# EAGLE design DESIGN7MA (EAGLE 9.6.1)
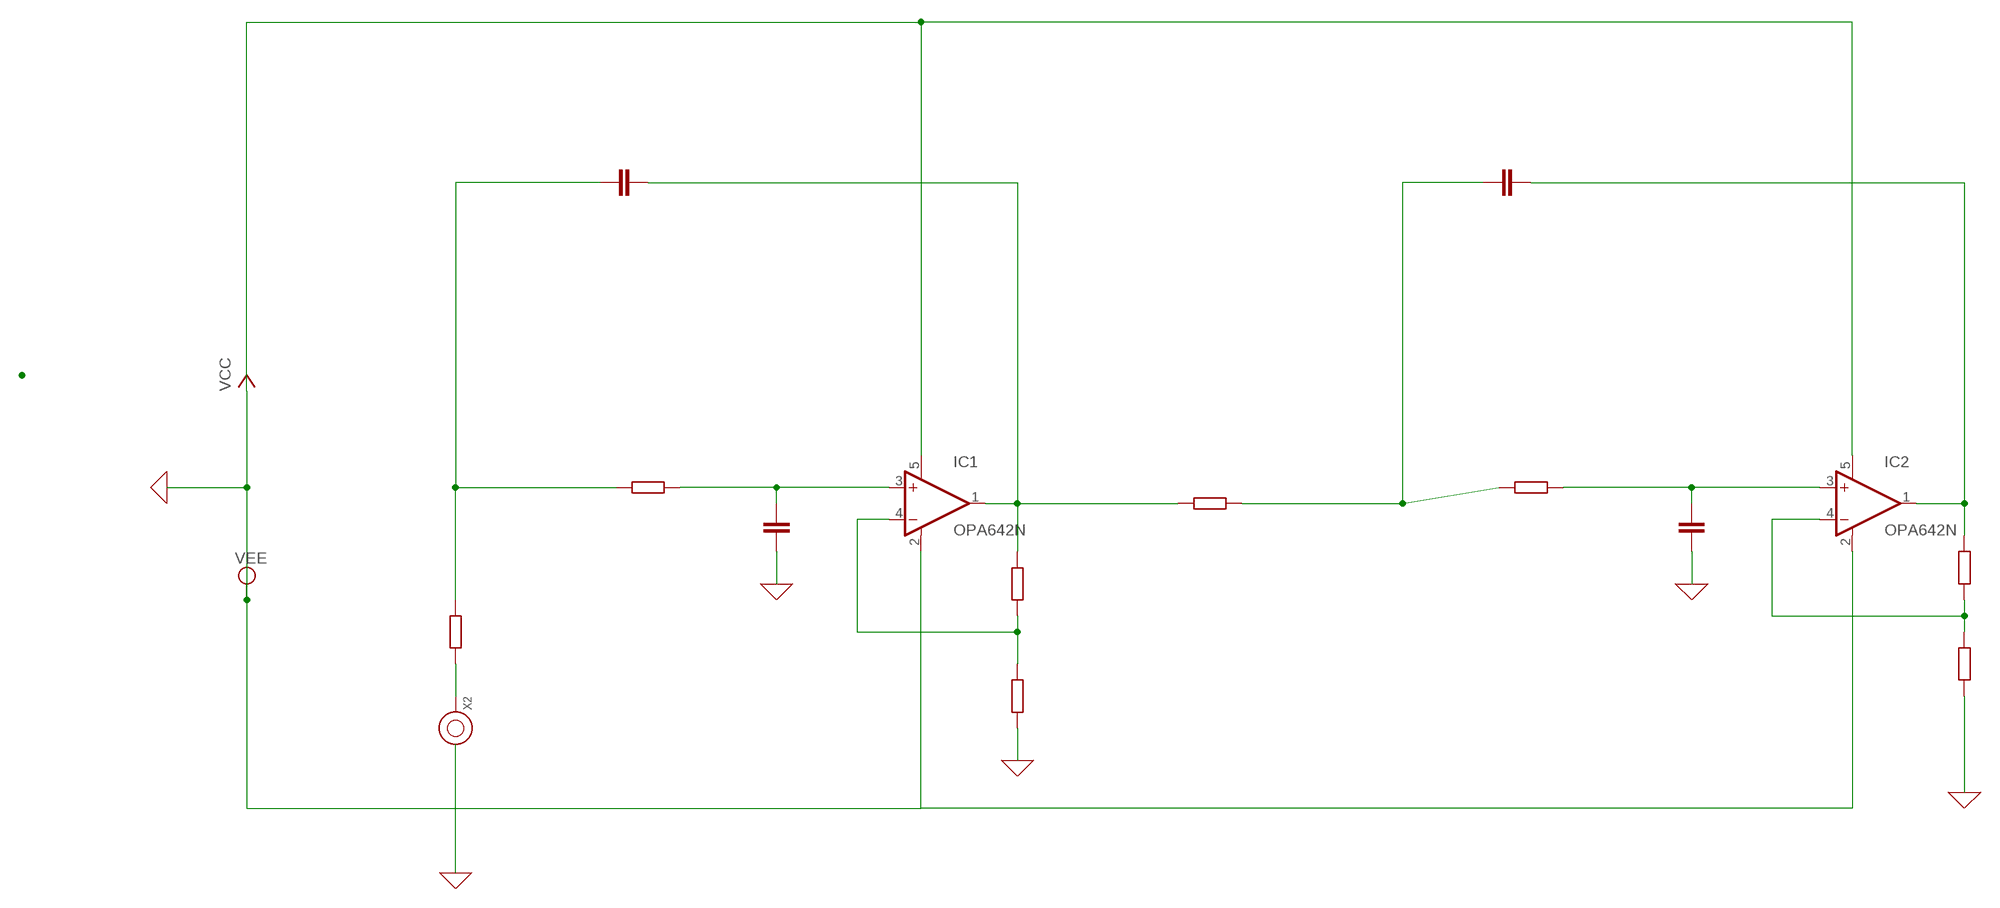
[diagram p0: schematic, sheet 1]

## Parts
IC1  OPA642N  [SOT23-5]
IC2  OPA642N  [SOT23-5]
X2  BINDING-POST  [BINDING-POST]

## Nets
0: IC1.2(V-) IC1.5(V+) IC2.2(V-) IC2.5(V+) ; supply symbol labelled GND, VCC, VEE
N$1: IC1.3(+IN)
N$2: IC1.1(OUT)
N$3: IC1.4(-IN)
N$4: IC2.1(OUT)
N$5: IC2.4(-IN)
N$7: IC2.3(+IN)
N$9: X2.1 X2.1_1 X2.1_2 X2.1_3 X2.1_4 X2.1_5 X2.1_6 X2.1_7 X2.1_8

## Library data of the parts
IC1 IC2 = burr-brown:OPA642N: Operational Amplifier Wideband, Low Distortion; OC_FARNELL: unknown; OC_NEWARK: unknown
X2 = binding-post_10:BINDING-POST: Binding post

## Board
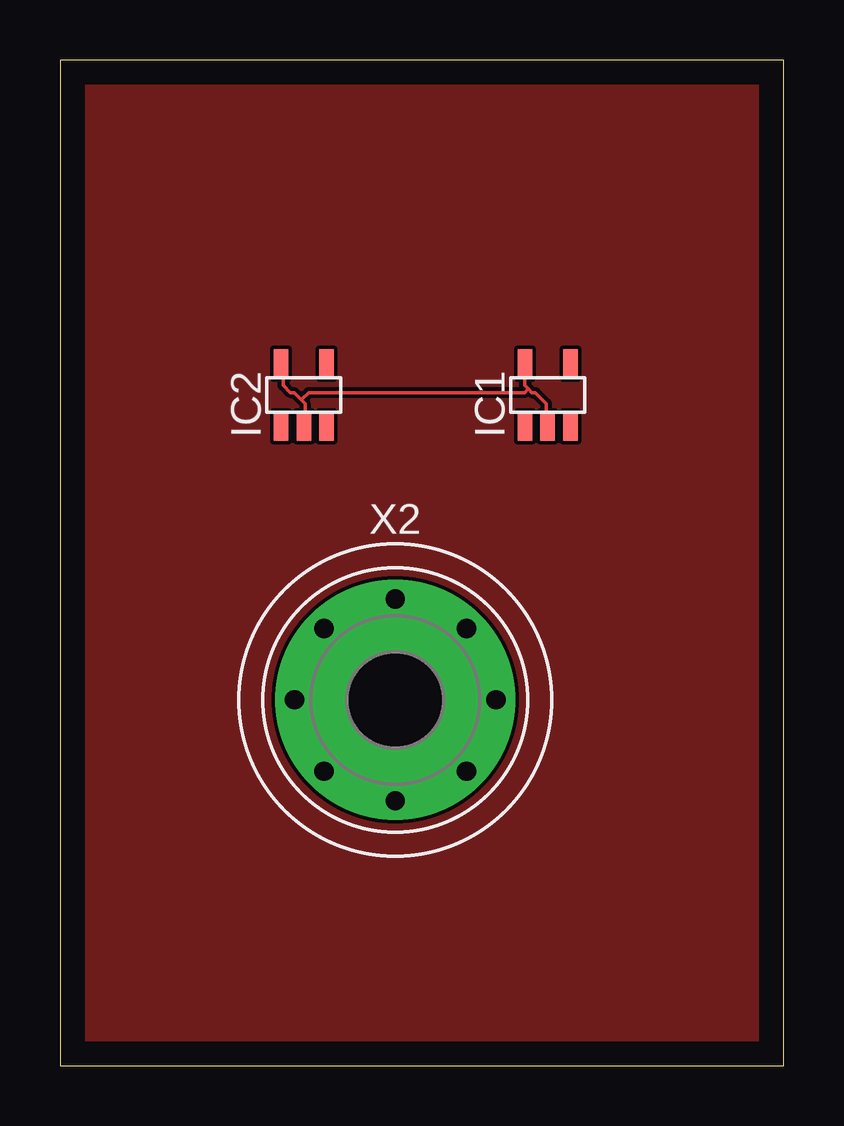
[diagram p1: board, top side]
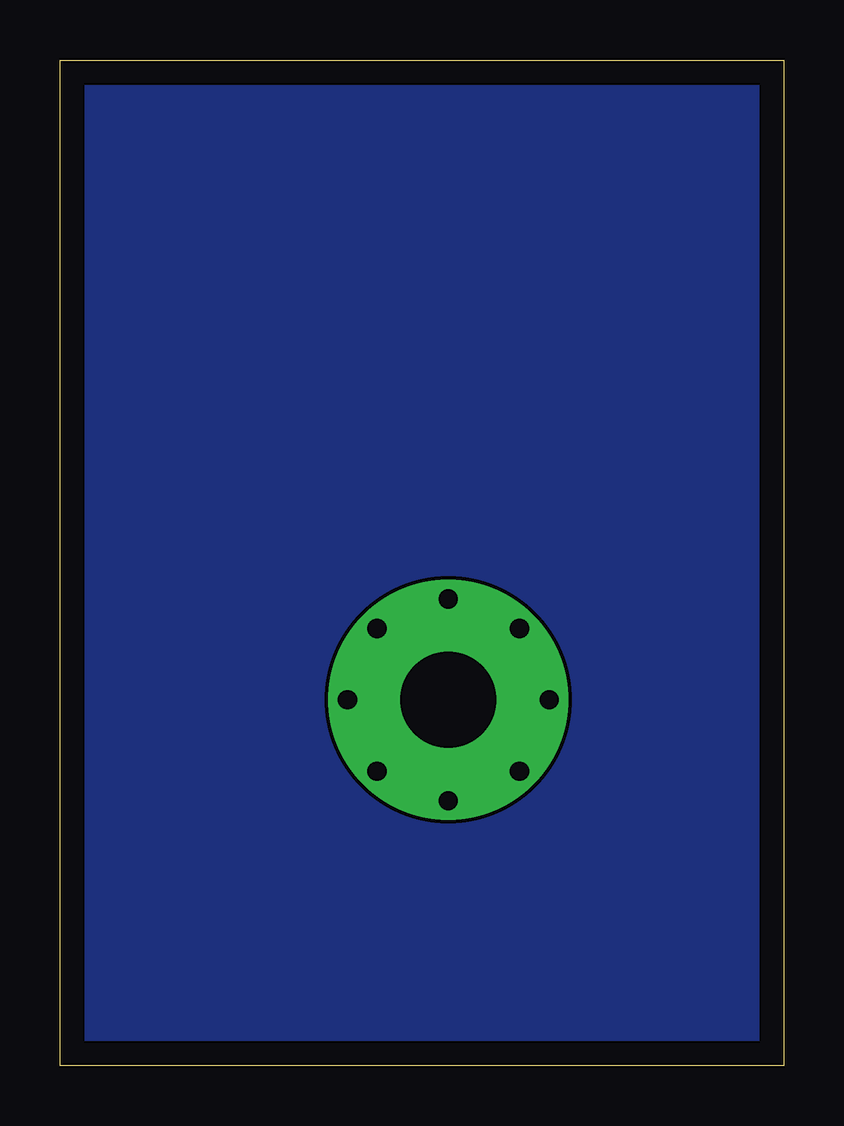
[diagram p2: board, bottom side, seen from below]

Size 30.15 x 41.9 mm. Coordinates in mm from the lower left corner, seen from the top.
Outline: 0,0 30.15,0 30.15,41.9 0,41.9 0,0
Copper layers (1*16): Top 0.035mm / dielectric 0.15mm / Bottom 0.035mm
Design rules "default": minimum track width 6mil, minimum drill 0.35mm, track to track 6mil, track to pad 6mil, pad to pad 6mil, via to via 6mil, smd to smd 6mil, copper to edge 40mil, drill to drill 6mil, minimum pad ring 10mil, minimum via ring 8mil, stop-mask expansion 4mil, vias tented up to drill 0mil, thermal gap 10mil

### Footprints (pad centres in the part's own frame; a part is rotated, then mirrored left to right if it is on the bottom)
SOT23-5 = smd 0.6 x 1.2: 1 -0.95,-1.306; 2 0,-1.306; 3 0.95,-1.306; 4 0.95,1.306; 5 -0.95,1.306
BINDING-POST = drill 4 pad 10: 1 0,0 | drill 0.8 pad 0.9: 1_1 4.2,0; 1_2 2.97,2.97; 1_3 0,4.2; 1_4 -2.97,2.97; 1_5 -4.2,0; 1_6 -2.97,-2.97; 1_7 0,-4.2; 1_8 2.97,-2.97

### Placement (x,y rotation side)
IC1  20.32,27.94 0 top
IC2  10.16,27.94 0 top
X2  13.97,15.24 0 top

### Tracks (layer width: path | path; a pad name or v marks a point on that pad's centre or on a via)
0
  Top 0.152: 10.06,27.74 9.75,28.04 9.6,28.04 9.3,28.35 9.3,29.11 IC2.5 | 10.06,27.74 10.21,27.58 10.21,26.67 IC2.2 | 19.51,28.19 19.36,28.35 19.36,29.11 IC1.5 | 19.51,28.19 19.66,28.04 19.81,28.04 20.27,27.58 20.27,26.67 IC1.2 | 10.06,27.74 10.36,28.04 19.36,28.04 19.51,28.19
MA
  pour Top: 0,41.91 0,0 30.48,0 30.48,41.91
MA1
  pour Bottom: 0,41.91 0,0 30.48,0 30.48,41.91
N$9
  Top 0.152: X2.1_5 9.91,15.24 9.91,17.07 10.97,18.14 X2.1_4 11.12,18.29 12.19,19.36 13.87,19.36 X2.1_3 14.02,19.36 15.09,18.29 | 15.09,18.29 16.92,18.29 X2.1_2 17.07,18.14 17.07,16.31 18.14,15.24 | X2.1_6 11.12,12.19 12.19,11.12 13.87,11.12 X2.1_7 14.02,11.12 15.85,11.12 16.92,12.19 X2.1_8 17.07,12.34 17.07,14.17 18.14,15.24 | 18.14,15.24 X2.1_1 | 15.09,18.29 15.09,16.31 14.02,15.24 X2.1